# Altium schematic sheet L5_Interface_V2.0.SchDoc
size 436 x 241 mm; SheetNumber: 1; SheetTotal: 1
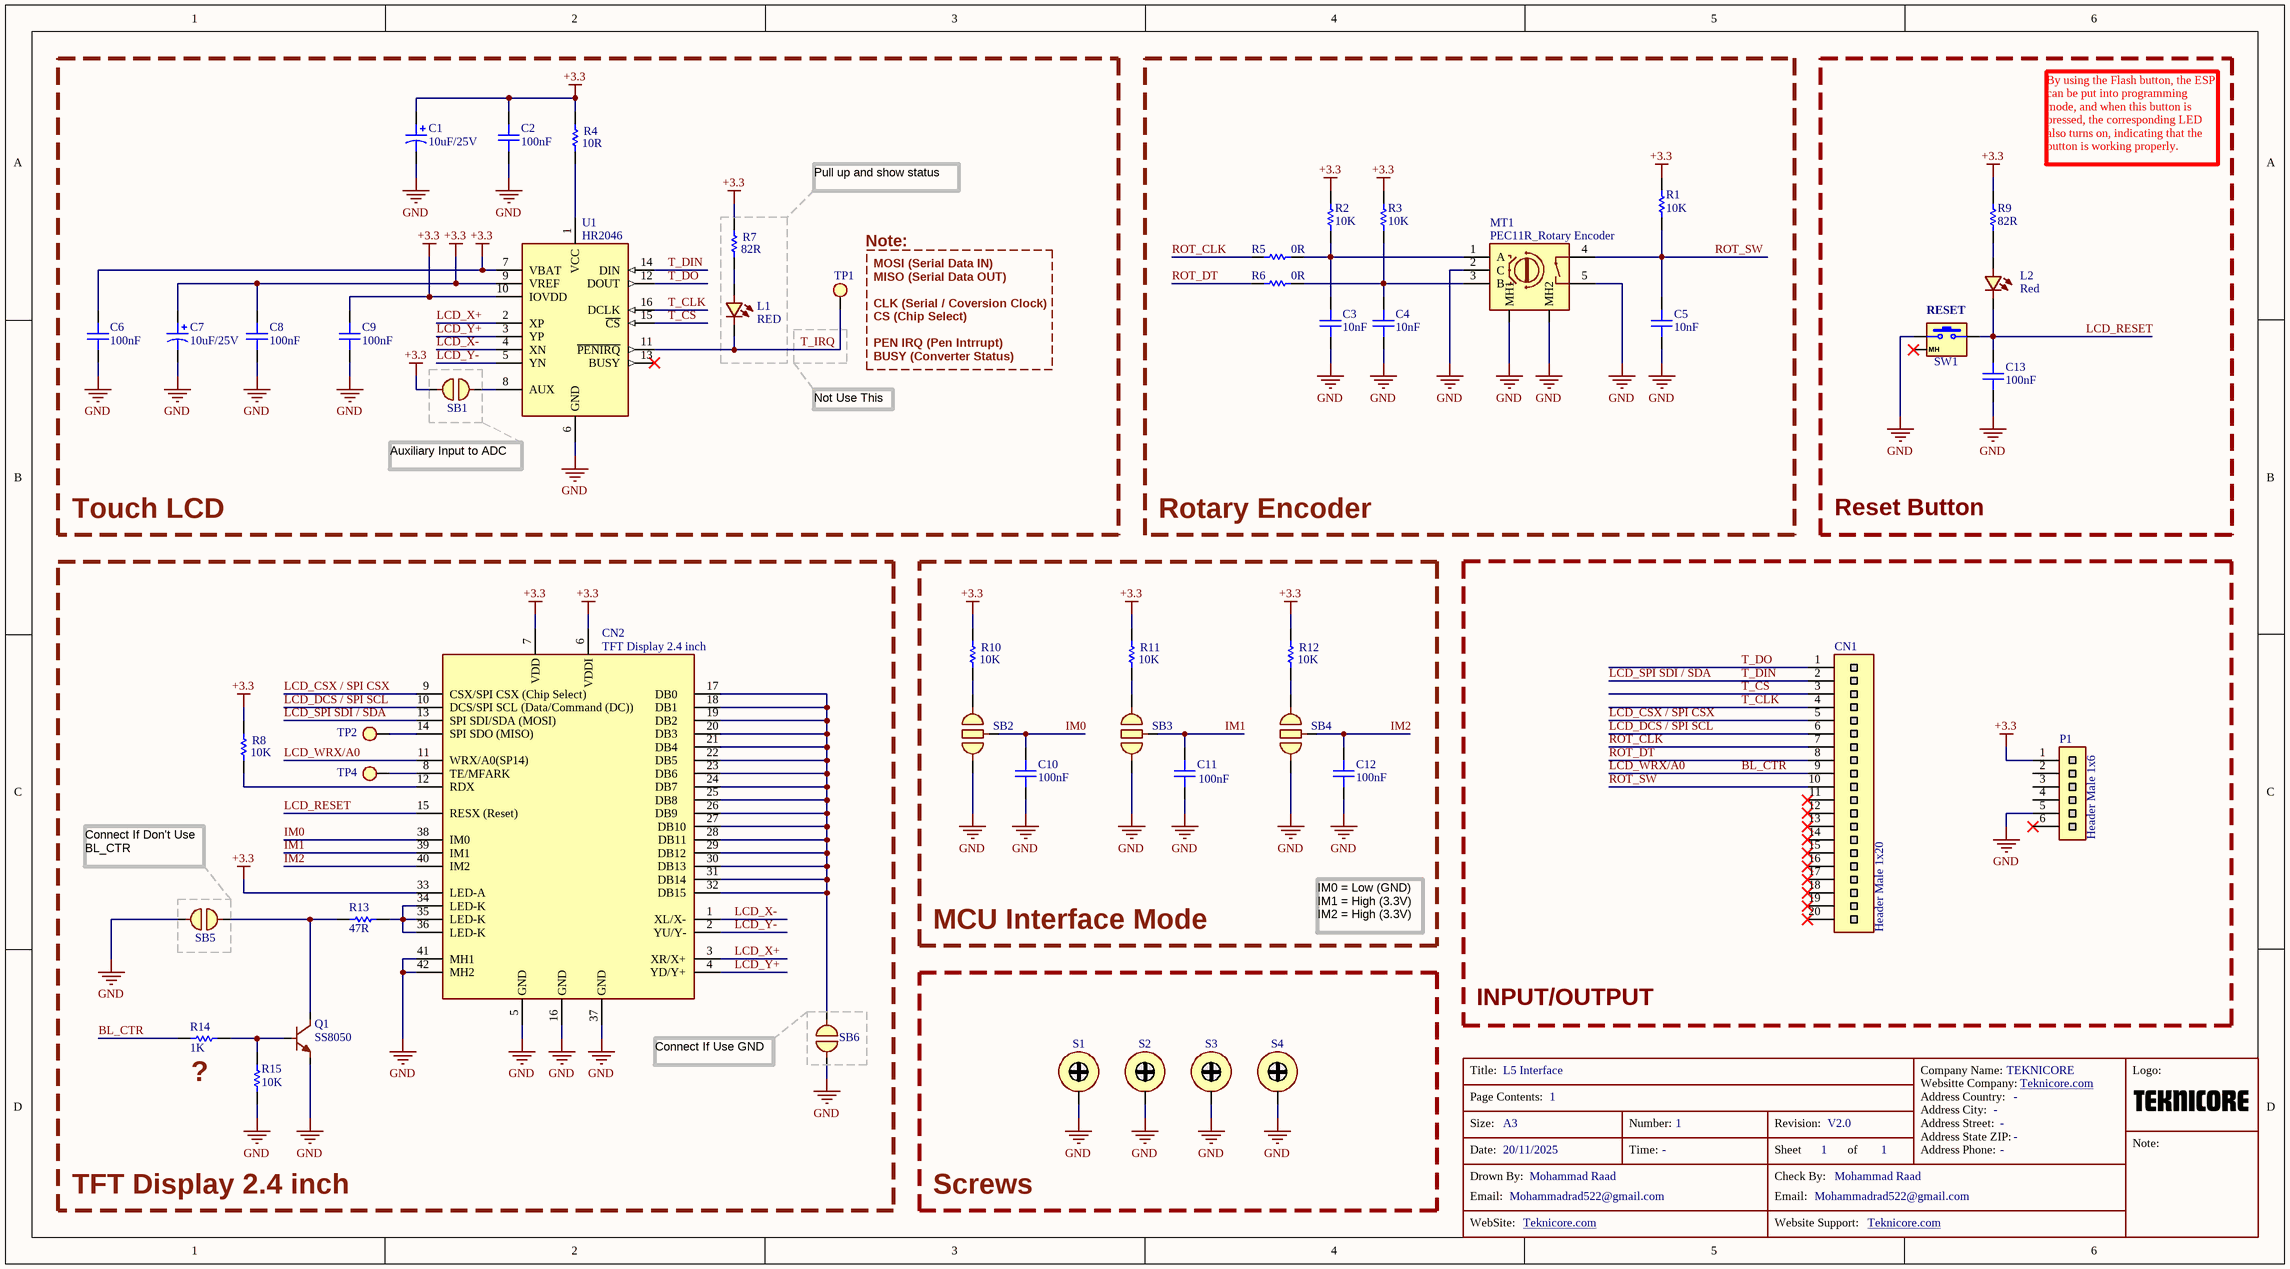
[diagram p0: L5_Interface_V2.0.SchDoc]

## Parts
C1  10uF/25V  [CAP_EL_B]
C2  100nF  [CAP1206]
C3  10nF  [CAP1206]
C4  10nF  [CAP1206]
C5  10nF  [CAP1206]
C6  100nF  [CAP1206]
C7  10uF/25V  [CAP_EL_B]
C8  100nF  [CAP1206]
C9  100nF  [CAP1206]
C10  100nF  [CAP1206]
C11  100nF  [CAP1206]
C12  100nF  [CAP1206]
C13  100nF  [CAP1206]
CN1  Header Male 1x20  [HDR_M_1x20PIN_0.2"]
CN2  TFT Display 2.4 inch  [FPC_Connector HIROSE_FH12A-40S-0.5SH(55)]
L1  RED  [LED 1206]
L2  Red  [LED 1206]
MT1  PEC11R_Rotary Encoder  [PEC11R_Rotary Encoder]
P1  Header Male 1x6  [HDR_M_1x6PIN_0.2"]
Q1  SS8050  [SOT23_M]
R1  10K  [Resistor_SMD_1206]
R2  10K  [Resistor_SMD_1206]
R3  10K  [Resistor_SMD_1206]
R4  10R  [Resistor_SMD_1206]
R5  0R  [Resistor_SMD_1206]
R6  0R  [Resistor_SMD_1206]
R7  82R  [Resistor_SMD_1206]
R8  10K  [Resistor_SMD_1206]
R9  82R  [Resistor_SMD_1206]
R10  10K  [Resistor_SMD_1206]
R11  10K  [Resistor_SMD_1206]
R12  10K  [Resistor_SMD_1206]
R13  47R  [Resistor_SMD_1206]
R14  1K  [Resistor_SMD_1206]
R15  10K  [Resistor_SMD_1206]
S1  Screw  [Screw 3mm-Invirons 0.254mm]  (value not drawn)
S2  Screw  [Screw 3mm-Invirons 0.254mm]  (value not drawn)
S3  Screw  [Screw 3mm-Invirons 0.254mm]  (value not drawn)
S4  Screw  [Screw 3mm-Invirons 0.254mm]  (value not drawn)
SB1  Solder Bridge  [SolderBridge_NC (100x80)(20)mil]  (value not drawn)
SB2  Solder Bridge  [SolderBridge_Small_NC_3Pin (70x50)(20)mil]  (value not drawn)
SB3  Solder Bridge  [SolderBridge_Small_NC_3Pin (70x50)(20)mil]  (value not drawn)
SB4  Solder Bridge  [SolderBridge_Small_NC_3Pin (70x50)(20)mil]  (value not drawn)
SB5  Solder Bridge  [SolderBridge_NC (100x80)(20)mil]  (value not drawn)
SB6  Solder Bridge  [SolderBridge_NC (100x80)(20)mil]  (value not drawn)
SW1  Push Button  [SW_PushBotton_Right]  (value not drawn)
T?  Title: L5 Interface  Page Conteents: 1  Size: A3  Drawn By: Mohammad Raad  Drown By (Email): Mohammadrad522@gmail.com  Website: Teknicore.com  Date: 20/11/2025  Reversion: V2.0  Company Name: TEKNICORE  (hidden comment: Title Block)  (graphical)
TP1  Test Point  [TestPoint_SMD_Circle_1.5mm]  (value not drawn)
TP2  Test Point  [TestPoint_SMD_Circle_1.5mm]  (value not drawn)
TP4  Test Point  [TestPoint_SMD_Circle_1.5mm]  (value not drawn)
U1  HR2046  [TSSOP16]

## Blocks framed on the sheet
Touch LCD: C1 C2 C6-C9 L1 R4 R7 SB1 TP1 U1
Rotary Encoder: C3-C5 MT1 R1-R3 R5 R6
Reset Button: C13 L2 R9 SW1
MCU Interface Mode: C10-C12 R10-R12 SB2-SB4
INPUT/OUTPUT: CN1 P1
Screws: S1-S4

## Nets
+3.3: C1.1 C2.2 C6.2 C7.1 C8.2 C9.2 CN2.6(VDDI) CN2.7(VDD) CN2.33(LED-A) P1.1 R1.2 R2.2 R3.2 R4.2 R7.2 R8.2 R9.2 R10.2 R11.2 R12.2 SB1.1 U1.7(VBAT) U1.9(VREF) U1.10(IOVDD)
GND: C1.2 C2.1 C3.1 C4.1 C5.1 C6.1 C7.2 C8.1 C9.1 C10.1 C11.1 C12.1 C13.1 CN2.5(GND) CN2.16(GND) CN2.37(GND) CN2.41(MH1) CN2.42(MH2) MT1.2(C) MT1.5 MT1.S1(MH1) MT1.S2(MH2) P1.5 Q1.2(E) R15.1 S1.S S2.S S3.S S4.S SB2.1 SB3.1 SB4.1 SB5.1 SB6.1 SW1.1 U1.6(GND)
BL_CTR: CN1.9 CN2.11(WRX/A0(SP14)) R14.2  [also labelled LCD_WRX/A0]
IM0: C10.2 CN2.38(IM0) SB2.2
IM1: C11.2 CN2.39(IM1) SB3.2
IM2: C12.2 CN2.40(IM2) SB4.2
LCD_CSX / SPI CSX: CN1.5 CN2.9(CSX/SPI_CSX_(Chip_Select))
LCD_DCS / SPI SCL: CN1.6 CN2.10(DCS/SPI_SCL_(Data/Command_(DC)))
LCD_RESET: C13.2 CN2.15(RESX_(Reset)) L2.K SW1.2
LCD_SPI SDI / SDA: CN1.2 CN2.13(SPI_SDI/SDA_(MOSI)) U1.14(DIN)  [also labelled T_DIN]
LCD_X+: CN2.3(XR/X+) U1.2(XP)
LCD_X-: CN2.1(XL/X-) U1.4(XN)
LCD_Y+: CN2.4(YD/Y+) U1.3(YP)
LCD_Y-: CN2.2(YU/Y-) U1.5(YN)
ROT_CLK: CN1.7 R5.1
ROT_DT: CN1.8 R6.1
ROT_SW: C5.2 CN1.10 MT1.4 R1.1
T_CLK: CN1.4 U1.16(DCLK)
T_CS: CN1.3 U1.15(~{CS})
T_DO: CN1.1 U1.12(DOUT)
T_IRQ: L1.K TP1.1 U1.11(~{PENIRQ})
NetC3_2: C3.2 MT1.1(A) R2.1 R5.2
NetC4_2: C4.2 MT1.3(B) R3.1 R6.2
NetCN2_8: CN2.8(TE/MFARK) TP4.1
NetCN2_12: CN2.12(RDX) R8.1
NetCN2_14: CN2.14(SPI_SDO_(MISO)) TP2.1
NetCN2_17: CN2.17(DB0) CN2.18(DB1) CN2.19(DB2) CN2.20(DB3) CN2.21(DB4) CN2.22(DB5) CN2.23(DB6) CN2.24(DB7) CN2.25(DB8) CN2.26(DB9) CN2.27(DB10) CN2.28(DB11) CN2.29(DB12) CN2.30(DB13) CN2.31(DB14) CN2.32(DB15) SB6.2
NetCN2_34: CN2.34(LED-K) CN2.35(LED-K) CN2.36(LED-K) R13.2
NetL1_A: L1.A R7.1
NetL2_A: L2.A R9.1
NetQ1_1: Q1.1(B) R14.1 R15.2
NetQ1_3: Q1.3(C) R13.1 SB5.2
NetR4_1: R4.1 U1.1(VCC)
NetR10_1: R10.1 SB2.3
NetR11_1: R11.1 SB3.3
NetR12_1: R12.1 SB4.3
NetSB1_2: SB1.2 U1.8(AUX)

Not connected (* = marked no-connect by the designer): CN1 11* 12* 13* 14* 15* 16* 17* 18* 19* 20*; P1 2 3 4 6*; SW1 MH*; U1 13(BUSY)*

## Notes on the sheet
- By using the Flash button, the ESP can be put into programming mode, and when this button is pressed, the corresponding LED also turns on, indicating that the button is working properly.
- Pull up and show status
- (near TP1) Note:
- (near TP1) MOSI (Serial Data IN)
- (near TP1) MISO (Serial Data OUT)
- (near TP1) PEN IRQ (Pen Intrrupt)
- (near TP1) CS (Chip Select)
- (near TP1) CLK (Serial / Coversion Clock)
- BUSY (Converter Status)
- RESET
- Not Use This
- (near U1) Auxiliary Input to ADC
- Connect If Don't Use BL_CTR
- IM0 = Low (GND)
  IM1 = High (3.3V)
  IM2 = High (3.3V)
- (near R14) ?
- Connect If Use GND
- TFT Display 2.4 inch
- (in symbol Title Block) Title:; Company Name:; Logo:; Websitte Company:; Page Contents:; Address Country:; Address City:; Size:; Number:; Revision:; Address Street:; Address State ZIP:; Note:; Date:; Time:; Sheet; of; Address Phone:; Drown By:; Check By:; Email:; WebSite:; Website Support:

## Library data of the parts
C1 C7 = Capacitor Electorolytic
C2-C6 C8-C13 = Capacitor Poliester & Ceramic
CN2 = TFT Display 2.4 inch: TFT Display 2.4 inch SPI TFT LCD color screen ILI9341 driver
L1 L2 = LED
MT1 = PEC11R_Rotary Encoder: Incremental Encoder, 12 Mm, Contact Rating 10 Ma - 5 Vdc; MP: PEC11R-4215F-S0024; Price: None; Availability: Unavailable; Value: *; Package: None
Q1 = SS8050: SS8050-G (NPN)
R1-R15 = Resistor
SB1 SB5 SB6 = Solder Bridge Short (NC): Solder Bridge Jumper
SB2-SB4 = Solder Bridge Short 3Pin (NC): Solder Bridge Jumper
SW1 = Push Button 4PIN Right
TP1 TP2 TP4 = TestPoint
U1 = XPT2046: driver IC XPT2046 touch screen controller components
T? = Title Block: Number Sheet: 1; This Sheet Number: 1; All Sheet Number: 1; Checked By: Mohammad Raad; Checked By (Email): Mohammadrad522@gmail.com; Website Support: Teknicore.com; Website Company: Teknicore.com; Address Country: -; Address City: -; Address Country Street: -; Address State ZIP: -; Address Phone: -; Time:: -